# EAGLE design exixe12 (EAGLE 8.2.2)
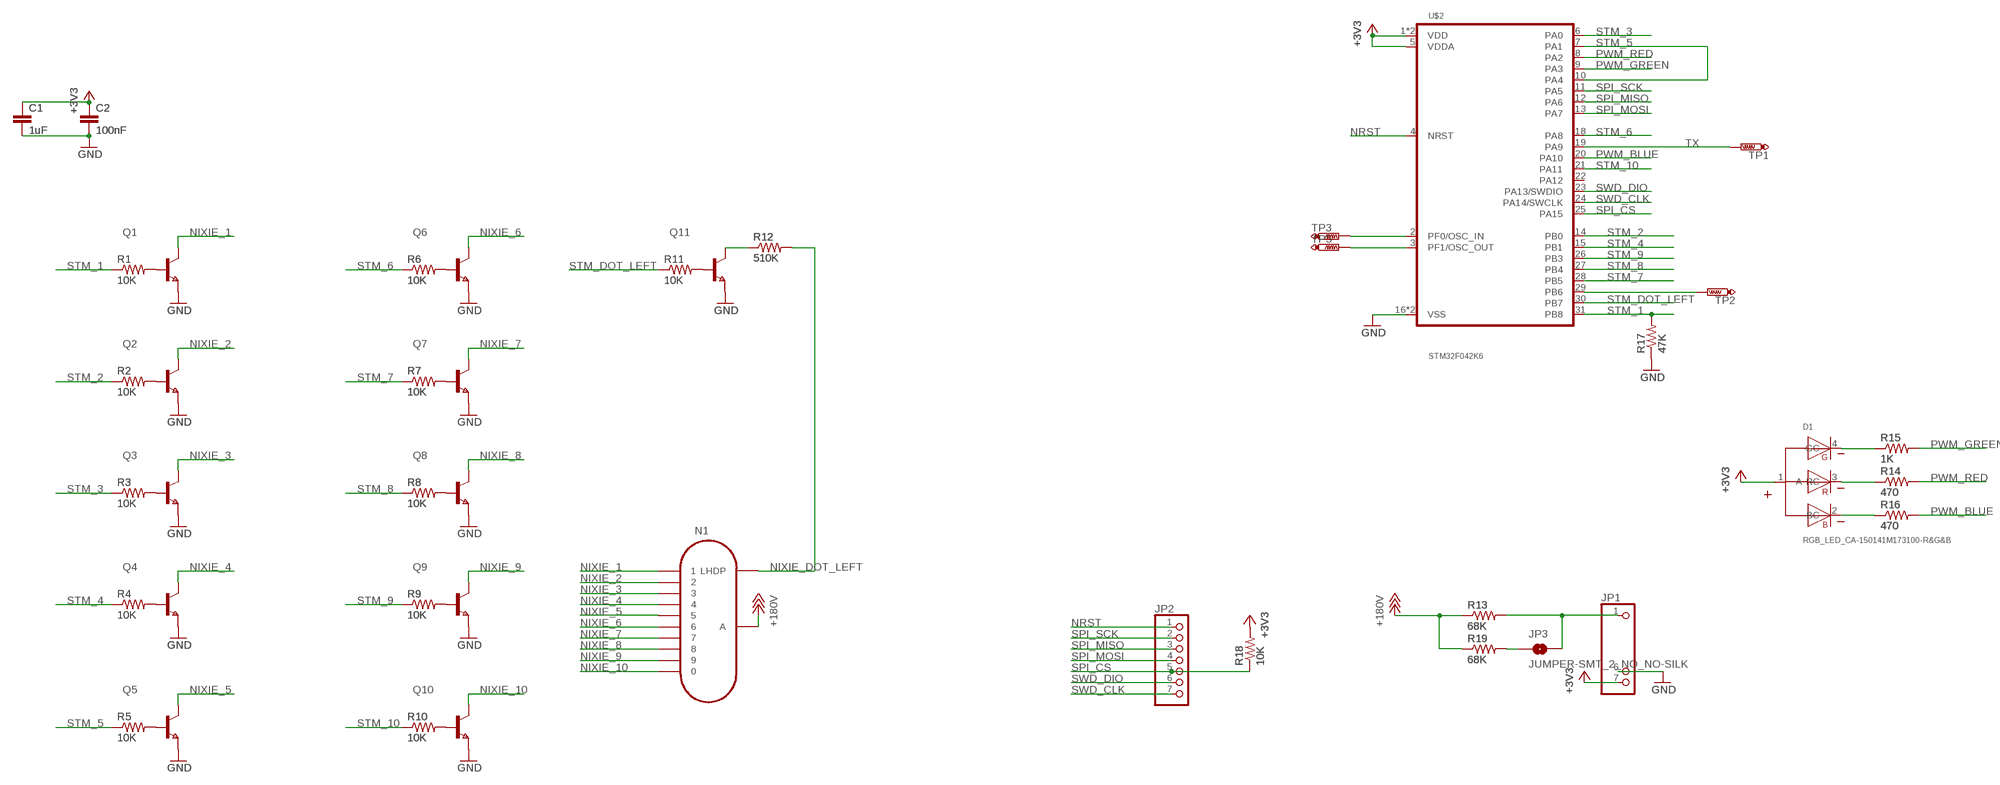
[diagram p0: schematic, sheet 1]

## Parts
C1  1uF  CAP0805  [0805]
C2  100nF  CAP0805  [0805]
D1  RGB_LED_CA-150141M173100-R&G&B  [3528-COMMON-ANODE]
JP1  PINHD-1X7  [1X07]
JP2  PINHD-1X7  [1X07]
JP3  JUMPER-SMT_2_NO_NO-SILK  [SMT-JUMPER_2_NO_NO-SILK]
N1  IN-12B  [IN-12]
Q1  BF820  [SOT323]
Q2  BF820  [SOT323]
Q3  BF820  [SOT323]
Q4  BF820  [SOT323]
Q5  BF820  [SOT323]
Q6  BF820  [SOT323]
Q7  BF820  [SOT323]
Q8  BF820  [SOT323]
Q9  BF820  [SOT323]
Q10  BF820  [SOT323]
Q11  BF820  [SOT323]
R1  10K  RESISTOR0805-RES  [0805]
R2  10K  RESISTOR0805-RES  [0805]
R3  10K  RESISTOR0805-RES  [0805]
R4  10K  RESISTOR0805-RES  [0805]
R5  10K  RESISTOR0805-RES  [0805]
R6  10K  RESISTOR0805-RES  [0805]
R7  10K  RESISTOR0805-RES  [0805]
R8  10K  RESISTOR0805-RES  [0805]
R9  10K  RESISTOR0805-RES  [0805]
R10  10K  RESISTOR0805-RES  [0805]
R11  10K  RESISTOR0805-RES  [0805]
R12  510K  RESISTOR0805-RES  [0805]
R13  68K  RESISTOR0805-RES  [0805]
R14  470  RESISTOR0805-RES  [0805]
R15  1K  RESISTOR0805-RES  [0805]
R16  470  RESISTOR0805-RES  [0805]
R17  47K  RESISTOR0805-RES  [0805]
R18  10K  RESISTOR0805-RES  [0805]
R19  68K  RESISTOR0805-RES  [0805]
TP1  PTR1TP13R  [TP13R]
TP2  PTR1TP13R  [TP13R]
TP3  PTR1TP13R  [TP13R]
TP5  PTR1TP13R  [TP13R]
U$2  STM32F042K6  [TQFP32-08]

## Nets
+3V3: C1.1 C2.1 D1.1(A) JP1.7 R18.2 U$2.1(VDD) U$2.5(VDDA) U$2.17(VDD)
+180V: N1.A R13.1 R19.1
GND: C1.2 C2.2 JP1.6 Q1.2(E) Q2.2(E) Q3.2(E) Q4.2(E) Q5.2(E) Q6.2(E) Q7.2(E) Q8.2(E) Q9.2(E) Q10.2(E) Q11.2(E) R17.1 U$2.16(VSS) U$2.32(VSS)
N$1: Q1.1(B) R1.2
N$2: JP3.1 R19.2
N$3: D1.4(GC) R15.1
N$4: Q2.1(B) R2.2
N$5: Q3.1(B) R3.2
N$6: Q4.1(B) R4.2
N$7: Q5.1(B) R5.2
N$8: Q6.1(B) R6.2
N$9: Q7.1(B) R7.2
N$10: Q8.1(B) R8.2
N$11: Q9.1(B) R9.2
N$12: Q10.1(B) R10.2
N$13: Q11.1(B) R11.2
N$14: TP2.TP U$2.29(PB6)
N$15: D1.3(RC) R14.1
N$16: TP3.TP U$2.2(PF0/OSC_IN)
N$17: TP5.TP U$2.3(PF1/OSC_OUT)
N$19: JP1.1 JP3.2 R13.2
N$21: D1.2(BC) R16.1
N$22: Q11.3(C) R12.1
NIXIE_1: N1.1 Q1.3(C)
NIXIE_2: N1.2 Q2.3(C)
NIXIE_3: N1.3 Q3.3(C)
NIXIE_4: N1.4 Q4.3(C)
NIXIE_5: N1.5 Q5.3(C)
NIXIE_6: N1.6 Q6.3(C)
NIXIE_7: N1.7 Q7.3(C)
NIXIE_8: N1.8 Q8.3(C)
NIXIE_9: N1.9 Q9.3(C)
NIXIE_10: N1.0 Q10.3(C)
NIXIE_DOT_LEFT: N1.LHDP R12.2
NRST: JP2.1 U$2.4(NRST)
PWM_BLUE: R16.2 U$2.20(PA10)
PWM_GREEN: R15.2 U$2.9(PA3)
PWM_RED: R14.2 U$2.8(PA2)
SPI_CS: JP2.5 R18.1 U$2.25(PA15)
SPI_MISO: JP2.3 U$2.12(PA6)
SPI_MOSI: JP2.4 U$2.13(PA7)
SPI_SCK: JP2.2 U$2.11(PA5)
STM_1: R1.1 R17.2 U$2.31(PB8)
STM_2: R2.1 U$2.14(PB0)
STM_3: R3.1 U$2.6(PA0)
STM_4: R4.1 U$2.15(PB1)
STM_5: R5.1 U$2.7(PA1) U$2.10(PA4)
STM_6: R6.1 U$2.18(PA8)
STM_7: R7.1 U$2.28(PB5)
STM_8: R8.1 U$2.27(PB4)
STM_9: R9.1 U$2.26(PB3)
STM_10: R10.1 U$2.21(PA11)
STM_DOT_LEFT: R11.1 U$2.30(PB7)
SWD_CLK: JP2.7 U$2.24(PA14/SWCLK)
SWD_DIO: JP2.6 U$2.23(PA13/SWDIO)
TX: TP1.TP U$2.19(PA9)
Unconnected: U$2.22(PA12)

## Library data of the parts
C1 C2 = joyAnalog:CAP: Capacitor Standard 0603 ceramic capacitor, and 0.1" leaded capacitor.
D1 = nixx:RGB_LED_CA: SMD full-color TOP LED Characteristics Low energy consumption High reliability Low current requirement Fast switching No UV/IR radiation High brightness RGB individual control Compact package outline Black surface Applications Flash light Switch indicators Equipments indicators Accent and decorative lighting Electronic signage Video displays Backlight for LCDs, PDAs and TVs Oven, microwave Street lighting Ideal for lateral coupling in light guides <http://katalog.we-online.de/media/images/eipal/WL-SFTW_pf2.jpg> Details see: http://katalog.we-online.de/en/led/WL-SFTW?m Updated 2015-04-10 2015 (C) Wurth Elektronik
JP1 = nixx:PINHD-1X7: PIN HEADER
JP2 = pinhead:PINHD-1X7: PIN HEADER
JP3 = SparkFun-Jumpers:JUMPER-SMT_2_NO: Normally open jumper This jumper has two pads in close proximity to each other. Apply solder to close the connection. Round pads are easier to solder for beginners, but are a lot larger. SparkFun Product that uses the round pads: SparkFun EL Sequencer <https://www.sparkfun.com/products/12781>
N1 = exixe12:IN-12B: IN-12B: medium numeric topview nixie tube
Q1-Q11 = nixx:BF820: NPN TRANSISTOR
R1-R19 = joyAnalog:RESISTOR: Resistor Basic schematic elements and footprints for 0603, 1206, and PTH resistors.
TP1-TP3 TP5 = nixx:PTR1: TEST PIN
U$2 = nixx:STM32F042K6

## Board
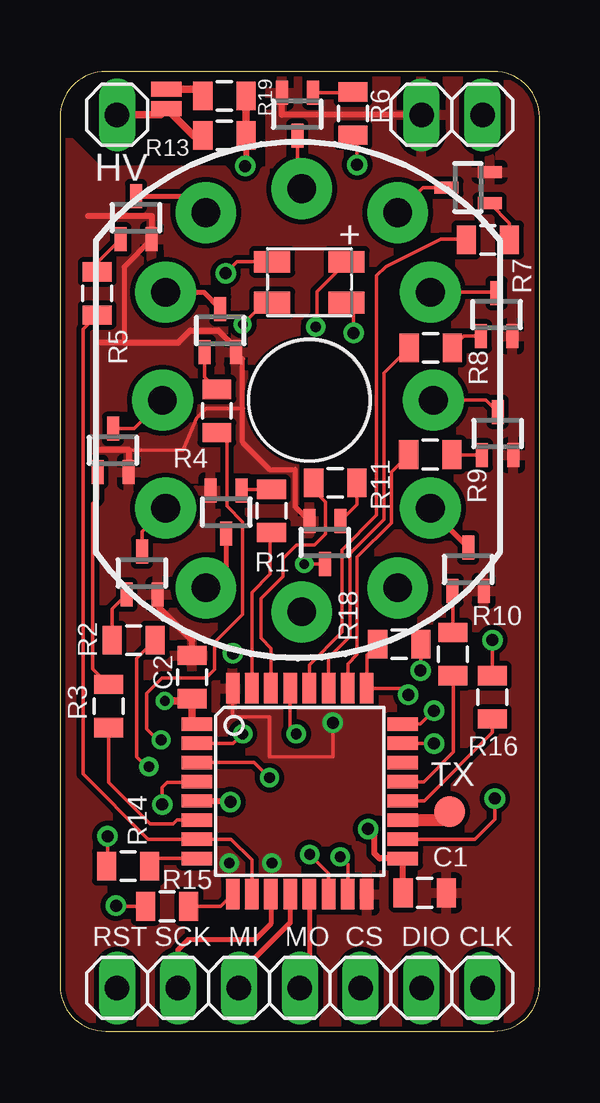
[diagram p1: board, top side]
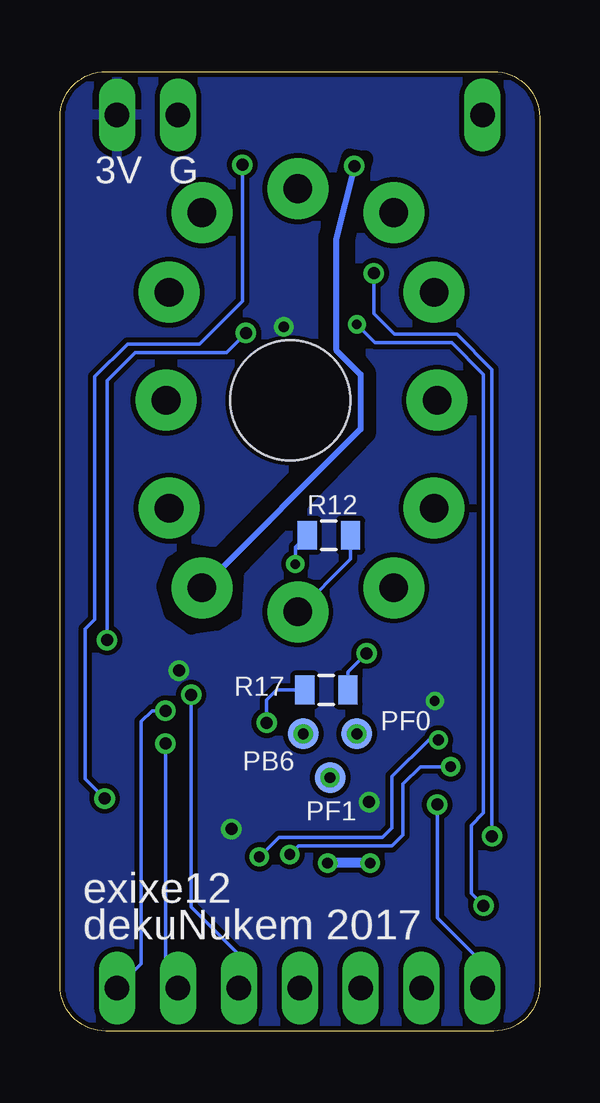
[diagram p2: board, bottom side, seen from below]

Size 20 x 40 mm. Coordinates in mm from the lower left corner, seen from the top.
Outline: 0,38.09 0,1.91 arc90 1.91,0 18.09,0 arc90 20,1.91 20,38.09 arc90 18.09,40 1.91,40 arc90 0,38.09
Copper layers (1*16): Top 0.035mm / dielectric 1.5mm / Bottom 0.035mm
Design rules "SparkFun-2-layer-TIGHT *": minimum track width 6mil, minimum drill 15mil, track to track 6mil, track to pad 6mil, pad to pad 6mil, via to via 6mil, smd to smd 6mil, copper to edge 6mil, drill to drill 6mil, minimum pad ring 7mil, minimum via ring 7mil, stop-mask expansion 4mil, vias tented up to drill 25mil, thermal gap 10mil
tRestrict: area 0.7,35.9 to 8.3,39.9
bRestrict: area 7.2,16.9 to 15.6,36.5

### Footprints (pad centres in the part's own frame; a part is rotated, then mirrored left to right if it is on the bottom)
0805 = smd 0.8 x 1.2: 1 -0.9,0; 2 0.9,0
3528-COMMON-ANODE = smd 1.5 x 0.9: 1 1.55,0.85; 2 1.55,-0.85; 3 -1.55,0.85; 4 -1.55,-0.85
1X07 = drill 1.016 long: 1 -7.62,0; 6 5.08,0; 7 7.62,0
1X07' = drill 1.016 long: 1 -7.62,0; 2 -5.08,0; 3 -2.54,0; 4 0,0; 5 2.54,0; 6 5.08,0; 7 7.62,0
SMT-JUMPER_2_NO_NO-SILK = smd 0.635 x 1.27: 1 -0.406,0; 2 0.406,0
IN-12 = drill 1.2 pad 2.54: 0 5.048,-4.5; 1 -4.317,-7.817; 2 -6,-4.5; 3 -6.127,0; 4 -6,4.5; 5 -4.317,7.817; 6 -0.318,8.818; 7 3.683,7.817; 8 5.048,4.5; 9 5.175,0; A 3.683,-7.817; LHDP -0.318,-8.818 | hole 5: 0,0
SOT323 = smd 0.5 x 1: 1 -0.65,-0.9; 2 0.65,-0.9; 3 0,0.9
TP13R = smd 1.3 x 1.3: TP 0,0
TQFP32-08 = smd 1.27 x 0.559: 1 -4.293,2.8; 2 -4.293,2; 3 -4.293,1.2; 4 -4.293,0.4; 5 -4.293,-0.4; 6 -4.293,-1.2; 7 -4.293,-2; 8 -4.293,-2.8; 17 4.293,-2.8; 18 4.293,-2; 19 4.293,-1.2; 20 4.293,-0.4; 21 4.293,0.4; 22 4.293,1.2; 23 4.293,2; 24 4.293,2.8 | smd 0.559 x 1.27: 9 -2.8,-4.293; 10 -2,-4.293; 11 -1.2,-4.293; 12 -0.4,-4.293; 13 0.4,-4.293; 14 1.2,-4.293; 15 2,-4.293; 16 2.8,-4.293; 25 2.8,4.293; 26 2,4.293; 27 1.2,4.293; 28 0.4,4.293; 29 -0.4,4.293; 30 -1.2,4.293; 31 -2,4.293; 32 -2.8,4.293

### Placement (x,y rotation side)
C1  15.21,5.77 0 top
C2  5.51,14.76 90 top
D1  10.4,31.22 0 top
JP1  10,38.2 0 top
JP2  [1X07']  10,1.8 0 top
JP3  4.45,38.86 270 top
N1  10.4,26.3 0 top
Q1  6.93,21.64 180 top
Q2  3.42,19.1 0 top
Q3  2.22,24.22 0 top
Q4  6.68,29.21 0 top
Q5  3.17,33.91 0 top
Q6  9.91,38.23 180 top
Q7  17.02,35.16 90 top
Q8  18.2,29.87 0 top
Q9  18.25,24.91 0 top
Q10  17.02,19.25 0 top
Q11  11.05,20.37 180 top
R1  8.82,21.69 90 top
R2  3.07,16.3 180 top
R3  2.03,13.55 90 top
R4  6.54,25.86 90 top
R5  1.55,30.76 90 top
R6  12.22,38.25 90 top
R7  17.84,32.98 0 top
R8  15.46,28.48 0 top
R9  15.44,24.04 0 top
R10  16.38,15.72 90 top
R11  11.48,22.86 0 top
R12  8.79,20.68 0 bottom
R13  6.86,37.34 180 top
R14  2.84,6.88 0 top
R15  4.47,5.21 0 top
R16  18.03,13.92 270 top
R17  8.89,14.22 0 bottom
R18  14.15,16.13 0 top
R19  6.86,38.99 180 top
TP1  16.26,9.14 0 top
TP2  9.86,12.4 0 bottom
TP3  7.62,12.4 0 bottom
TP5  8.74,10.57 0 bottom
U$2  10,10 0 top

### Tracks (layer width: path | path; a pad name or v marks a point on that pad's centre or on a via)
+3V3  (via drill 0.4, 0.45, 0.5)
  Top 0.152: R18.2 v15.05,15.05 v15.04,15.04 | D1.1 10.72,30.84 10.72,29.41 v10.67,29.36
  Top 0.254: U$2.5 7.06,9.6 v7.11,9.55 | C1.1 14.29,5.79 U$2.17 13.32,7.2 13.11,7.42 13.11,8.18 v12.85,8.43
  Top 0.305: v4.37,13.77 5.42,13.77 C2.1 5.51,13 U$2.1
  pour Bottom (isolate 0.203): 0,40 20,40 20,0 0,0
+180V  (via drill 0.5)
  Top 0.254: R13.1 7.76,36.1 v7.72,36.07
  Top 0.305: R19.1 R13.1
  Bottom 0.254: v7.72,36.07 8.48,33.02 8.48,28.4 7.47,27.38 7.47,25.1 N1.A
GND  (via drill 0.45, 0.5)
  Top 0.152: 7.62,25.96 6.1,25.96 5.69,25.55 5.13,24.23 2.87,24.23 | U$2.32 7.2,13.11 8.74,13.11 8.74,11.43 11.38,11.43 v11.38,12.85
  Top 0.203: Q11.2 9.8,21.86 9.8,23.42 8.74,23.42 7.62,24.54 7.62,25.96 7.62,28.02 Q4.2 | Q5.2 2.67,31.85 2.67,28.7
  Top 0.254: C2.2 5.51,16.28 4.12,17.68 4.12,18.15 Q2.2 | Q5.2 3.83,33.98 1.17,33.98 | Q4.2 7.33,28.48 6.6,29.21 5.44,29.21 4.93,28.7 2.67,28.7 1.52,28.7 1.52,24.23 2.87,24.23 Q3.2 | JP1.6 9.26,38.2 Q6.2
  Bottom 0.152: R17.1 10.97,14.22 11.38,13.82 v11.38,12.85
  Bottom 0.406: v7.06,7.01 v8.84,7.01
  pour Top (isolate 0.203): 0,40 20,40 20,0 0,0
N$1
  Top 0.152: R1.2 7.63,22.59 Q1.1
N$2
  Top 0.305: JP3.1 5.68,39.27 R19.2
N$3  (via drill 0.4, 0.5)
  Top 0.152: R15.1 2.36,5.21 v2.34,5.23 | D1.4 8.53,30.37 v7.62,29.46
  Bottom 0.152: v2.34,5.23 2.85,5.74 2.85,8.59 2.34,9.09 2.34,27.38 3.66,28.7 6.86,28.7 v7.62,29.46
N$4
  Top 0.152: R2.2 2.17,17.6 Q2.1
N$5
  Top 0.152: Q3.1 1.57,22.19 1.37,22 1.37,15.11 R3.2
N$6
  Top 0.152: Q4.1 6.03,27.27 R4.2
N$7
  Top 0.152: R5.2 1.55,32.04 Q5.1
N$8
  Top 0.152: R6.2 12.2,39.13 Q6.1
N$9
  Top 0.152: R7.2 18.74,33.69 Q7.1
N$10
  Top 0.152: R8.2 16.85,28.97 Q8.1
N$11
  Top 0.152: R9.2 16.37,24.01 Q9.1
N$12
  Top 0.152: R10.2 16.38,18.35 Q10.1
N$13
  Top 0.152: R11.2 12.38,21.95 Q11.1
N$14  (via drill 0.45)
  Top 0.152: U$2.29 9.6,12.65 TP2.TP
  other vias: 9.86,12.4
N$15  (via drill 0.5)
  Top 0.152: v6.91,31.6 7.38,32.07 D1.3 | v1.98,8.13 1.98,6.92 R14.1
  Bottom 0.152: v1.98,8.13 1.98,27.58 3.45,29.06 6.04,29.06 6.91,29.92 v6.91,31.6
N$16  (via drill 0.45)
  Top 0.152: U$2.2 7.22,12 TP3.TP
  other vias: 7.62,12.4
N$17  (via drill 0.45)
  Top 0.152: U$2.3 8.1,11.2 TP5.TP
  other vias: 8.74,10.57
N$19
  Top 0.305: JP1.1 4.19,38.2 JP3.2 5.56,37.34 R13.2
N$21  (via drill 0.5)
  Top 0.152: R16.1 v18.03,16.31 | v12.24,29.11 12.24,30.08 D1.2
  Bottom 0.152: v12.24,29.11 13.06,28.3 16.87,28.3 18.03,27.13 v18.03,16.31
N$22  (via drill 0.4)
  Top 0.152: Q11.3 v10.19,19.47
  Bottom 0.152: R12.1 10.19,20.18 v10.19,19.47
NIXIE_1
  Top 0.203: Q1.3 6.93,19.33 N1.1
NIXIE_2
  Top 0.152: Q2.3 3.42,20.82 N1.2
NIXIE_3
  Top 0.152: Q3.3 3.09,25.12 N1.3
NIXIE_4
  Top 0.203: N1.4 5.99,30.8 Q4.3
NIXIE_5
  Top 0.203: Q5.3 5.39,34.81 N1.5
NIXIE_6
  Top 0.152: Q6.3 9.91,35.29 N1.6
NIXIE_7
  Top 0.152: Q7.3 15.13,35.16 N1.7
NIXIE_8
  Top 0.152: Q8.3 18.18,30.8 N1.8
NIXIE_9
  Top 0.152: Q9.3 17.77,26.3 N1.9
NIXIE_10
  Top 0.203: N1.0 15.45,21.73 Q10.3
NIXIE_DOT_LEFT
  Bottom 0.152: R12.2 7.89,19.68 N1.LHDP
NRST  (via drill 0.5)
  Top 0.152: v4.27,9.45 4.27,10.16 4.47,10.36 5.67,10.36 U$2.4
  Bottom 0.152: JP2.1 2.39,2.85 4.27,4.72 v4.27,9.45
PWM_BLUE
  Top 0.152: U$2.20 15.19,9.6 18.03,12.45 R16.2
PWM_GREEN
  Top 0.152: U$2.9 6.7,5.21 R15.2
PWM_RED
  Top 0.152: U$2.8 4.06,7.2 R14.2
SPI_CS  (via drill 0.5)
  Top 0.152: v14.53,14.02 14.26,14.29 U$2.25 12.8,15.68 R18.1
  Bottom 0.152: JP2.5 12.55,3.2 14.53,5.18 v14.53,14.02
SPI_MISO
  Top 0.203: U$2.12 9.6,4.52 7.49,2.41 7.49,1.83 JP2.3
SPI_MOSI
  Top 0.203: U$2.13 10.4,2.2 JP2.4
SPI_SCK
  Top 0.203: JP2.2 4.92,3.4 5.33,3.81 8.13,3.81 8.8,4.48 U$2.11
STM_1  (via drill 0.5)
  Top 0.152: 8,15.74 8,18.29 8.76,19.05 8.76,20.73 R1.1 | 8,15.74 U$2.31 | v7.21,15.75 8,15.75 8,15.74
  Bottom 0.152: v7.21,15.75 7.99,14.97 R17.2
STM_2  (via drill 0.45)
  Top 0.152: R2.1 3.2,15.53 3.2,11.43 3.61,11.02 v3.71,11.02 | U$2.14 11.2,6.58 v10.41,7.37
  Bottom 0.152: v3.71,11.02 4.98,11.02 5.69,10.31 5.69,8.18 6.15,7.72 10.06,7.72 v10.41,7.37
STM_3
  Top 0.152: R3.1 2.02,10.37 3.76,8.64 4.72,8.64 4.89,8.8 U$2.6
STM_4  (via drill 0.45)
  Top 0.152: R4.1 6.96,24.54 6.96,21.89 7.62,21.23 7.62,17.37 6.45,16.2 6.45,15.09 6.1,14.73 4.27,14.73 3.61,14.07 3.61,12.6 4.06,12.14 v4.22,12.14 | U$2.15 12,6.95 v11.68,7.26
  Bottom 0.152: v4.22,12.14 4.62,12.14 6.15,10.62 6.15,8.48 6.55,8.08 10.87,8.08 v11.68,7.26
STM_5
  Top 0.152: R5.1 0.96,29.27 0.96,10.72 3.68,8 U$2.7 7.14,8 8,7.14 U$2.10
STM_6  (via drill 0.5)
  Top 0.152: R6.1 12.39,37.18 v12.39,36.12 | v18.14,9.7 18.14,8.84 17.3,8 U$2.18
  Bottom 0.152: v12.39,36.12 12.39,30.43 14.17,28.65 17.17,28.65 18.54,27.28 18.54,17.17 18.95,16.76 18.95,10.52 v18.14,9.7
STM_7
  Top 0.152: R7.1 16.91,33.02 15.88,33.02 13.59,31.88 13.21,31.5 13.21,21.51 11.76,20.07 11.76,16.64 10.4,15.28 U$2.28
STM_8
  Top 0.152: R8.1 13.51,27.44 13.51,21.34 12.09,19.91 12.09,16.46 11.2,15.57 U$2.27
STM_9
  Top 0.152: R9.1 13.82,23.31 13.82,21.18 12.39,19.76 12.39,15.7 12,15.3 U$2.26
STM_10
  Top 0.152: R10.1 16.41,14.79 16.41,11.63 15.18,10.4 U$2.21
STM_DOT_LEFT
  Top 0.152: U$2.30 8.8,15.96 8.38,16.38 8.38,18.03 9.3,18.95 9.3,19.71 9.86,20.27 10.62,20.27 11.07,20.73 11.07,22.06 10.58,22.55 R11.1
SWD_CLK  (via drill 0.5)
  Top 0.152: U$2.24 15.04,12.8 v15.6,13.36
  Bottom 0.152: v15.6,13.36 16.15,13.36 16.61,12.9 16.61,2.81 JP2.7
SWD_DIO  (via drill 0.5)
  Top 0.152: U$2.23 15.58,12 v15.6,11.99
  Bottom 0.152: v15.6,11.99 15.6,2.32 JP2.6
TX
  Top 0.508: U$2.19 15.91,8.8 TP1.TP

### Text on the board
tNames: HV | + | TX | RST | SCK | MI | MO | CS | DIO | CLK
bNames: G | 3V | PF0 | PB6 | PF1 | exixe12 | dekuNukem 2017